# Altium schematic sheet MCU.SchDoc
size A
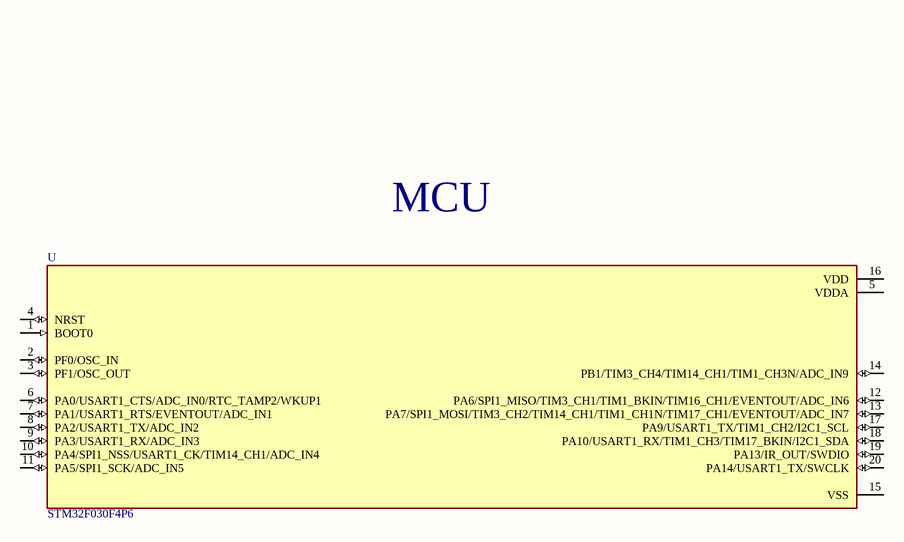
[diagram p0: MCU.SchDoc]

## Parts
U  STM32F030F4P6  [SOP65P640X120-20N]

## Nets

Not connected (* = marked no-connect by the designer): U 1(BOOT0) 2(PF0/OSC_IN) 3(PF1/OSC_OUT) 4(NRST) 5(VDDA) 6(PA0/USART1_CTS/ADC_IN0/RTC_TAMP2/WKUP1) 7(PA1/USART1_RTS/EVENTOUT/ADC_IN1) 8(PA2/USART1_TX/ADC_IN2) 9(PA3/USART1_RX/ADC_IN3) 10(PA4/SPI1_NSS/USART1_CK/TIM14_CH1/ADC_IN4) 11(PA5/SPI1_SCK/ADC_IN5) 12(PA6/SPI1_MISO/TIM3_CH1/TIM1_BKIN/TIM16_CH1/EVENTOUT/ADC_IN6) 13(PA7/SPI1_MOSI/TIM3_CH2/TIM14_CH1/TIM1_CH1N/TIM17_CH1/EVENTOUT/ADC_IN7) 14(PB1/TIM3_CH4/TIM14_CH1/TIM1_CH3N/ADC_IN9) 15(VSS) 16(VDD) 17(PA9/USART1_TX/TIM1_CH2/I2C1_SCL) 18(PA10/USART1_RX/TIM1_CH3/TIM17_BKIN/I2C1_SDA) 19(PA13/IR_OUT/SWDIO) 20(PA14/USART1_TX/SWCLK)

## Notes on the sheet
- MCU

## Library data of the parts
U = STM32F030F4P6: ARMÂ® CortexÂ®-M0 STM32F0 Microcontroller IC 32-Bit 48MHz 16KB _16K x 8_ FLASH; MF: STMicroelectronics; MP: STM32F030F4P6; Package: TSSOP-20 STMicroelectronics; SnapEDA_Link: https://www.snapeda.com/parts/STM32F030F4P6/STMicroelectronics/view-part/46809/?ref=snap; Digi-Key_Purchase_URL: https://www.digikey.vn/product-detail/en/stmicroelectronics/STM32F030F4P6/497-14044-5-ND/4357517?utm_source=snapeda&utm_medium=aggregator&utm_campaign=symbol; Value: *; Digi-Key_Part_Number: 497-14044-5-ND